# Altium schematic sheet 05_Supply_Power.SchDoc
size A; SheetNumber: 3; SheetTotal: 3
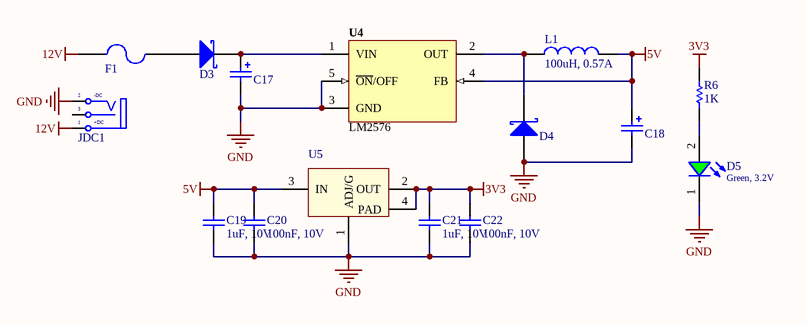
[diagram p0: 05_Supply_Power.SchDoc]

## Parts
C17  100uF  [WCAP-ATG8_D6.3H11]  (value not drawn)
C18  1000uF  [WCAP-ATG8_D10H20]  (value not drawn)
C19  1uF, 10V  [WCAP-CSGP_0603_H=0.8mm_Reflow]
C20  100nF, 10V  [WCAP-CSGP_0603_H=0.8mm_Reflow]
C21  1uF, 10V  [WCAP-CSGP_0603_H=0.8mm_Reflow]
C22  100nF, 10V  [WCAP-CSGP_0603_H=0.8mm_Reflow]
D3  D Schottky  [SS34]  (value not drawn)
D4  D Schottky  [SS34]  (value not drawn)
D5  Green, 3.2V  [WL-SMCW_0603_H=0.25mm]
F1  Fuse  [FUSE SMD]  (value not drawn)
JDC1  Jack DC  [DC-IN]  (value not drawn)
L1  100uH, 0.57A  [WE-PD2A_5848]
R6  value 1K  [RES-SM-0603]  (hidden comment: RESISTOR SMD)
U4  LM2576  [TO263]
U5  LM1117  [SOT223-4N]  (value not drawn)

## Nets
3V3: C21.2 C22.2 R6.2 U5.2(OUT) U5.4(PAD)
5V: C18.1(P) C19.2 C20.2 L1.2 U4.4(FB) U5.3(IN)
12V: F1.1 JDC1.1(T)
GND: C17.2(N) C18.2(N) C19.1 C20.1 C21.1 C22.1 D4.1(A) D5.1(K) JDC1.2(TN) U4.3(GND) U4.5(~{ON}/OFF) U5.1(ADJ/G)
NetC17_1: C17.1(P) D3.2(K) U4.1(VIN)
NetD3_1: D3.1(A) F1.2
NetD4_2: D4.2(K) L1.1 U4.2(OUT)
NetD5_2: D5.2(A) R6.1

Not connected (* = marked no-connect by the designer): JDC1 3(S)

## Notes on the sheet
- (in symbol Jack DC) -DC; +DC

## Library data of the parts
C17 = 860010473007: WCAP-ATG8 Aluminum Electrolytic Capacitor, Radial THT, D6.3xH11mm, 100uF, 25V; Manufacturer: Wurth Elektronik; Capacitance Tolerance: +/-20%; Dissipation Factor: 14%; Endurance: 2000h; Leakage Current: 25uA; Ripple Current: 209mA; Technical Reference: ATBD110101M025DSPA4B000; ComponentLink1Description: Manufacturer Link; ComponentLink1URL: https://www.we-online.com/redexpert/article/860010473007?ad; ComponentLink2Description: Datasheet; ComponentLink2URL: https://www.we-online.com/redexpert/spec/860010473007?ad; Category: Aluminum Electrolytic Capacitors; Match Code: WCAP-ATG8; Manufacturer Part Number: 860010473007; Mount: Through Hole; Operating Temperature Max: 85°C; Operating Temperature Min: -40°C; Packaging: Ammo Pack; Height: 11mm; Diameter: 6.3mm; Capacitance: 100uF; Rated Voltage (DC): 25V
C18 = 860010475017: WCAP-ATG8 Aluminum Electrolytic Capacitor, Radial THT, D10xH20mm, 1000uF, 25V; Manufacturer: Wurth Elektronik; Capacitance Tolerance: +/-20%; Dissipation Factor: 14%; Endurance: 2000h; Leakage Current: 250uA; Ripple Current: 1050mA; Technical Reference: ATBF200102M025DSPAAB000; ComponentLink1Description: Manufacturer Link; ComponentLink1URL: https://www.we-online.com/redexpert/article/860010475017?ad; ComponentLink2Description: Datasheet; ComponentLink2URL: https://www.we-online.com/redexpert/spec/860010475017?ad; Category: Aluminum Electrolytic Capacitors; Match Code: WCAP-ATG8; Manufacturer Part Number: 860010475017; Mount: Through Hole; Operating Temperature Max: 85°C; Operating Temperature Min: -40°C; Packaging: Ammo Pack; Height: 20mm; Diameter: 10mm; Capacitance: 1000uF; Rated Voltage (DC): 25V
C19 C21 = 885012106010: WCAP-CSGP Multilayer Ceramic Chip Capacitor, General Purpose, size 0603, X5R, 1uF, 10V; Manufacturer: Wurth Elektronik; Rated Voltage: 10VDC; Isolation Resistance: >=0.1GOhm; Capacitance Tolerance: +/-20%; Technical Reference: X5R0603105M010DFCT10000; ComponentLink1Description: Manufacturer; ComponentLink1URL: http://www.we-online.de; ComponentLink2Description: Datasheet; ComponentLink2URL: https://www.we-online.com/catalog/datasheet/885012106010.pdf; Operating Temperature: -55 to +85degC; Packaging: Tape and Reel; Manufacturer Part Number: 885012106010; Published Date: May 2020; Ceramic Type: X5R; Dissipation Factor: =<10%; Height: 0.8mm; Mounting Technology: SMT; Size: 0603; Capacitance: 1uF
C20 C22 = 885012206020: WCAP-CSGP Multilayer Ceramic Chip Capacitor, General Purpose, size 0603, X7R, 100nF, 10V; Manufacturer: Wurth Elektronik; Rated Voltage: 10VDC; Isolation Resistance: >=5GOhm; Capacitance Tolerance: +/-10%; Technical Reference: X7R0603104K010DFCT10000; ComponentLink1Description: Manufacturer; ComponentLink1URL: http://www.we-online.de; ComponentLink2Description: Datasheet; ComponentLink2URL: https://www.we-online.com/catalog/datasheet/885012206020.pdf; Operating Temperature: -55 to +125degC; Packaging: Tape and Reel; Manufacturer Part Number: 885012206020; Published Date: May 2020; Ceramic Type: X7R; Dissipation Factor: =<5%; Height: 0.8mm; Mounting Technology: SMT; Size: 0603; Capacitance: 100nF
D3 D4 = D Schottky: Schottky Diode; Published: 8-Jun-2000; LatestRevisionDate: 17-Jul-2002; LatestRevisionNote: Re-released for DXP Platform.; PackageReference: SMB; Publisher: Altium Limited; PackageDescription: DO-214-AA/SMB; 2 C-Bend Leads; Body 5.3 x 3.6 mm, inc. leads (LxW); Code_JEDEC: DO-214-AA
D5 = 150060GS75020: WL-SMCW SMT Mono-color Chip LED Waterclear, size 0603, Green, 3.2V, 140deg; Chip Technology: InGaN; Dominant Wavelength typ.: 525nm; Luminous Intensity typ.: 700mcd; Peak Wavelength typ.: 515nm; Viewing Angle: 140deg; ComponentLink1Description: Manufacturer; ComponentLink1URL: http://www.we-online.de; ComponentLink2URL: https://www.we-online.com/catalog/datasheet/150060GS75020.pdf; ComponentLink2Description: Datasheet; Forward Voltage typ.: 3.2V; Emitting Color: Green; Mounting Technology: SMT; Operating Temperature: -40 to +85degC; Published Date: March 2020; Part Number: 150060GS75020; Packaging: Tape and Reel; Size: 0603; Publisher: Wurth Elektronik
JDC1 = Jack DC: Jack DC input; Value: Jac DC
L1 = 78477420: WE-PD2A SMT Power Inductor, size 5848, 100uH, 0.57A; Manufacturer: Wurth Elektronik; DC Resistance max.: 0.65Ohm; Saturation Current: 0.68A; Self Resonant Frequency: 7MHz; DC Resistance typ.: 0.51Ohm; Rated Voltage: 80VDC; ComponentLink1Description: Manufacturer; ComponentLink1URL: http://www.we-online.de; ComponentLink2Description: Datasheet; ComponentLink2URL: https://www.we-online.com/catalog/datasheet/78477420.pdf; Manufacturer Part Number: 78477420; Published Date: May 2020; Rated Current: 0.57A; Inductance: 100uH; Operating Temperature: -40 to +125degC; Mounting Technology: SMT; Packaging: Tape and Reel; Size: 5848
R6 = RESISTOR SMD: Resistor
U4 = LM2576: Max Input Voltage: 12 V; Max Output Current: 3 (6.0 peak) A; Max Output Voltage: mV; Category: IC-Power; Min Input Voltage: mV; Min Output Voltage: mV; Mounting Technology: Surface Mount; Status: Unreleased; Supply Voltage: mV; Temperature Range: -40 to +125 degC
U5 = LM1117: Available in 1.8V, 2.5V, 2.85V, 3.3V, 5V, and  Adjustable Versions; Value: LM317